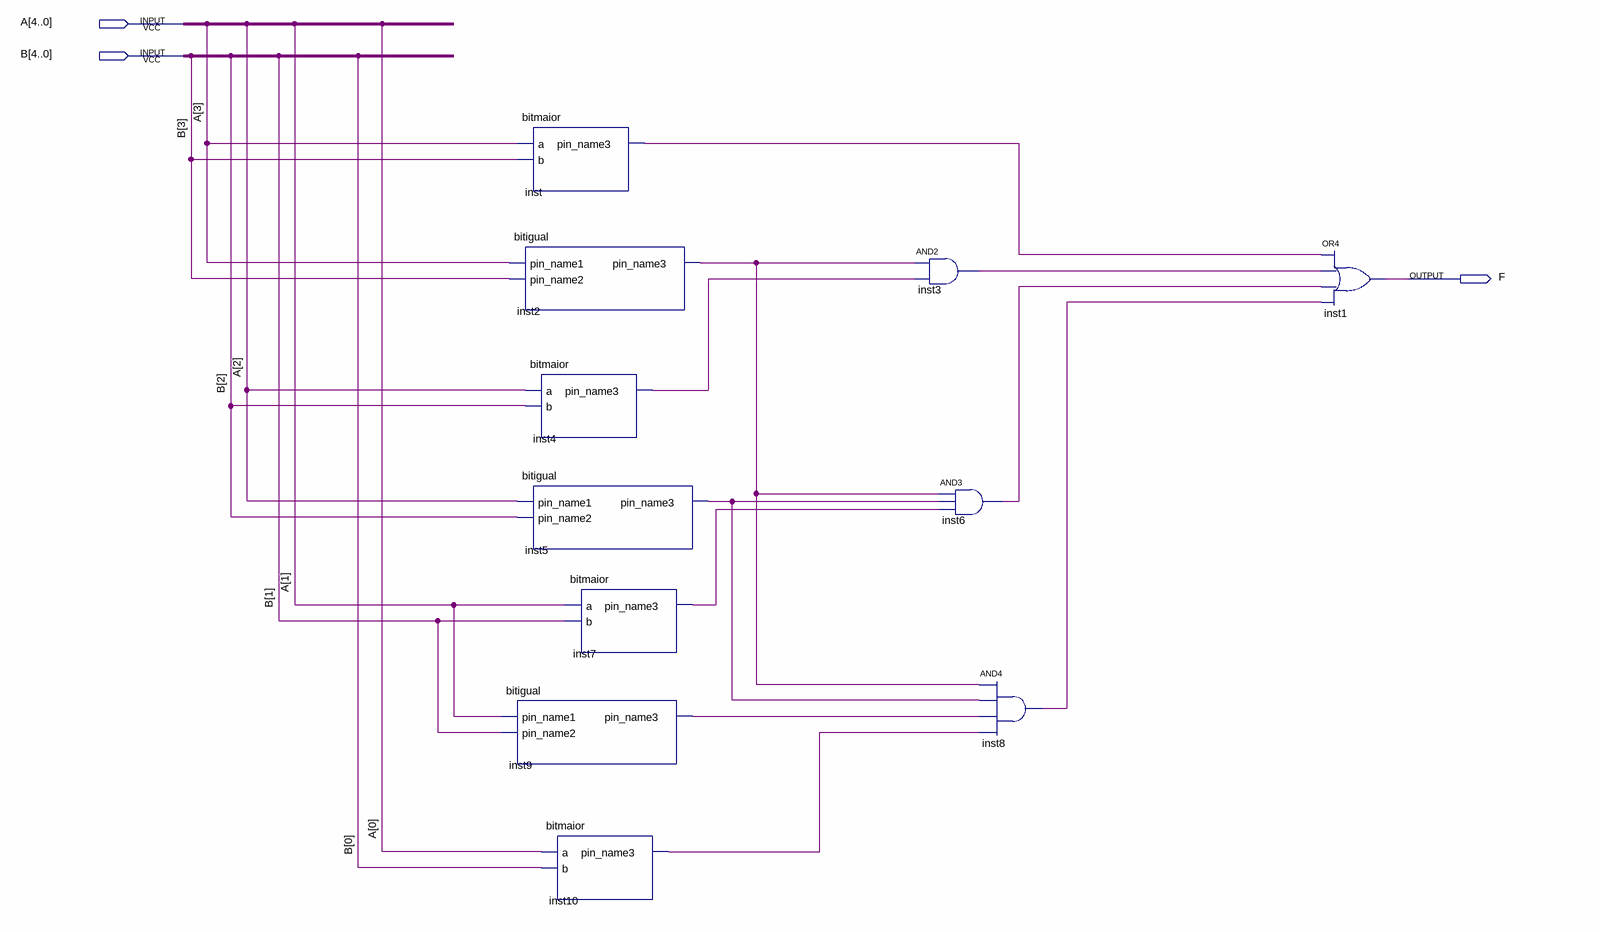
[diagram p0: schematic sheet]
// Quartus schematic comparamag.bdf as structural Verilog: 11 symbols, 3 pins
module comparamag (
  input  [4:0] A,
  input  [4:0] B,
  output F
);

  wire inst2_pin_name3, inst3_out, inst4_pin_name3, inst5_pin_name3, inst6_out, inst7_pin_name3, inst8_out,
       inst9_pin_name3, inst10_pin_name3, inst_pin_name3;

  bitmaior inst (.a(A[3]), .b(B[3]), .pin_name3(inst_pin_name3));
  bitigual inst2 (.pin_name1(A[3]), .pin_name2(B[3]), .pin_name3(inst2_pin_name3));
  bitmaior inst4 (.a(A[2]), .b(B[2]), .pin_name3(inst4_pin_name3));
  bitigual inst5 (.pin_name1(A[2]), .pin_name2(B[2]), .pin_name3(inst5_pin_name3));
  bitigual inst9 (.pin_name1(A[1]), .pin_name2(B[1]), .pin_name3(inst9_pin_name3));
  bitmaior inst10 (.a(A[0]), .b(B[0]), .pin_name3(inst10_pin_name3));
  bitmaior inst7 (.a(A[1]), .b(B[1]), .pin_name3(inst7_pin_name3));
  and inst3 (inst3_out, inst2_pin_name3, inst4_pin_name3);
  and inst6 (inst6_out, inst2_pin_name3, inst5_pin_name3, inst7_pin_name3);
  and inst8 (inst8_out, inst2_pin_name3, inst5_pin_name3, inst9_pin_name3, inst10_pin_name3);
  or inst1 (F, inst_pin_name3, inst3_out, inst6_out, inst8_out);
endmodule
